# Altium schematic sheet [12]IO_PORT.SchDoc
size A4
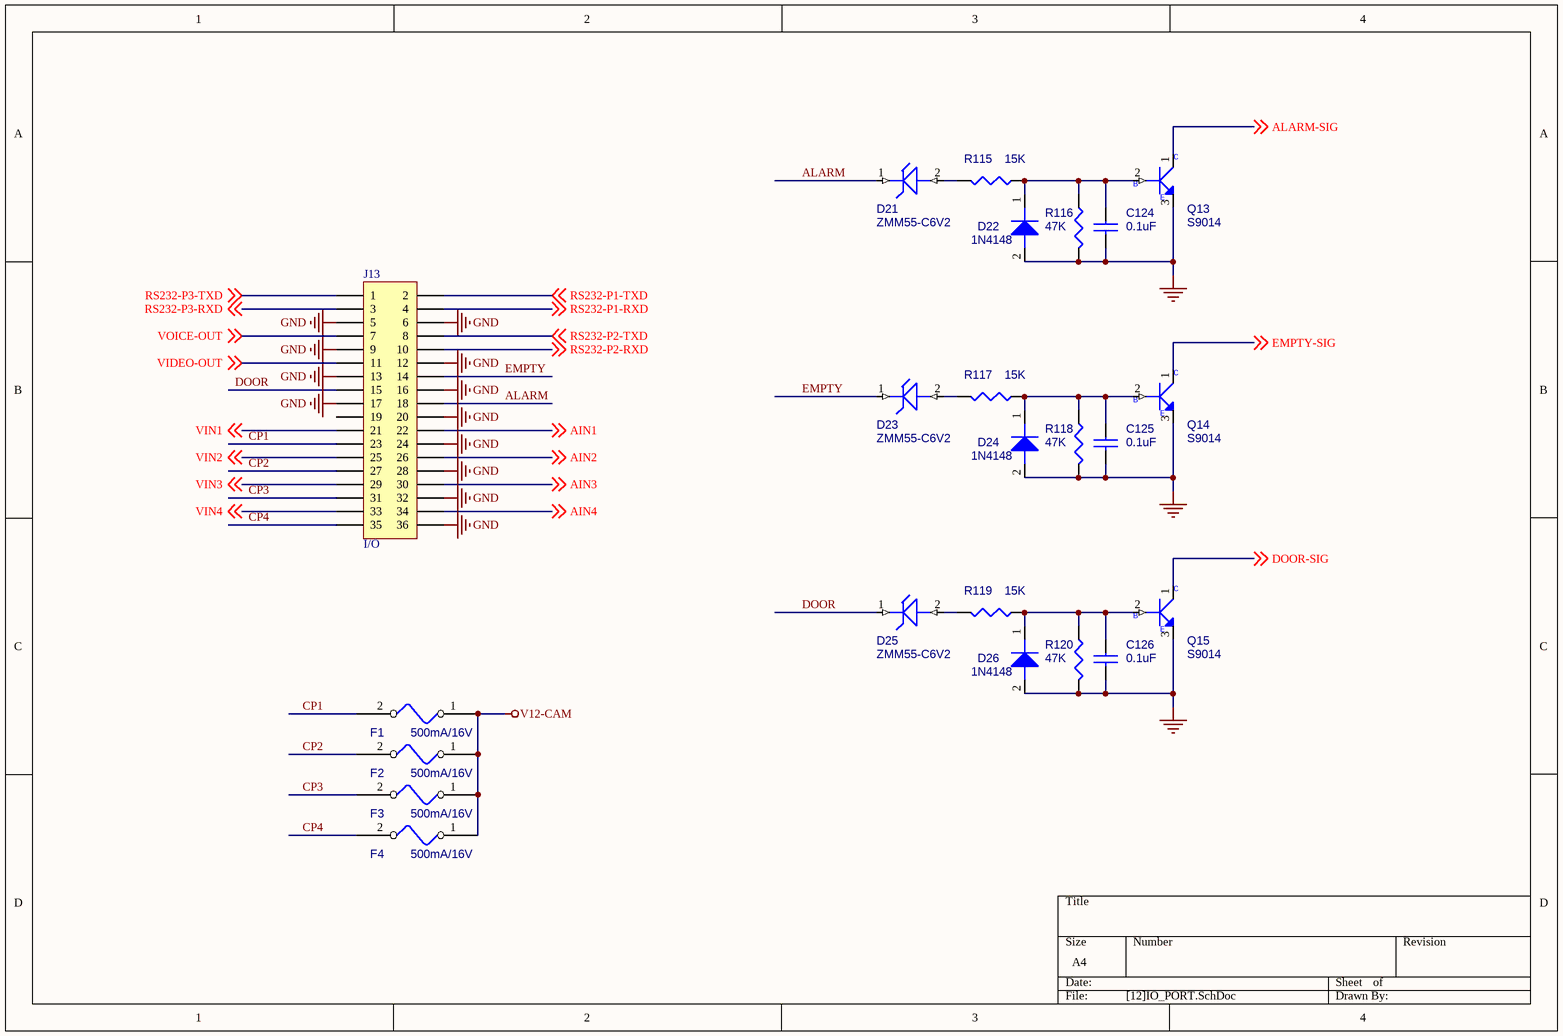
[diagram p0: [12]IO_PORT.SchDoc]

## Parts
C124  0.1uF  [0603]
C125  0.1uF  [0603]
C126  0.1uF  [0603]
D21  ZMM55-C6V2  [MINI-MELF]
D22  1N4148  [MINI-MELF]
D23  ZMM55-C6V2  [MINI-MELF]
D24  1N4148  [MINI-MELF]
D25  ZMM55-C6V2  [MINI-MELF]
D26  1N4148  [MINI-MELF]
F1  500mA/16V  [1812]
F2  500mA/16V  [1812]
F3  500mA/16V  [1812]
F4  500mA/16V  [1812]
J13  I/O  [AMP174146]
Q13  S9014  [NPN]
Q14  S9014  [NPN]
Q15  S9014  [NPN]
R115  15K  [0603]
R116  47K  [0603]
R117  15K  [0603]
R118  47K  [0603]
R119  15K  [0603]
R120  47K  [0603]

## Nets
GND: C124.2 C125.2 C126.2 D22.2 D24.2 D26.2 J13.5 J13.6 J13.9 J13.12 J13.13 J13.16 J13.17 J13.20 J13.24 J13.28 J13.32 J13.36 Q13.3(EMITTER) Q14.3(EMITTER) Q15.3(EMITTER) R116.2 R118.2 R120.2
V12-CAM: F1.1 F2.1 F3.1 F4.1
AIN1: J13.22 ; off-sheet AIN1
AIN2: J13.26 ; off-sheet AIN2
AIN3: J13.30 ; off-sheet AIN3
AIN4: J13.34 ; off-sheet AIN4
ALARM: D21.1 J13.18
ALARM-SIG: Q13.1(COLLECTOR) ; off-sheet ALARM-SIG
CP1: F1.2 J13.23
CP2: F2.2 J13.27
CP3: F3.2 J13.31
CP4: F4.2 J13.35
DOOR: D25.1 J13.15
DOOR-SIG: Q15.1(COLLECTOR) ; off-sheet DOOR-SIG
EMPTY: D23.1 J13.14
EMPTY-SIG: Q14.1(COLLECTOR) ; off-sheet EMPTY-SIG
RS232-P1-RXD: J13.4 ; off-sheet RS232-P1-RXD
RS232-P1-TXD: J13.2 ; off-sheet RS232-P1-TXD
RS232-P2-RXD: J13.10 ; off-sheet RS232-P2-RXD
RS232-P2-TXD: J13.8 ; off-sheet RS232-P2-TXD
RS232-P3-RXD: J13.3 ; off-sheet RS232-P3-RXD
RS232-P3-TXD: J13.1 ; off-sheet RS232-P3-TXD
VIDEO-OUT: J13.11 ; off-sheet VIDEO-OUT
VIN1: J13.21 ; off-sheet VIN1
VIN2: J13.25 ; off-sheet VIN2
VIN3: J13.29 ; off-sheet VIN3
VIN4: J13.33 ; off-sheet VIN4
VOICE-OUT: J13.7 ; off-sheet VOICE-OUT
NetC124_1: C124.1 D22.1 Q13.2(BASE) R115.1 R116.1
NetC125_1: C125.1 D24.1 Q14.2(BASE) R117.1 R118.1
NetC126_1: C126.1 D26.1 Q15.2(BASE) R119.1 R120.1
NetD21_2: D21.2 R115.2
NetD23_2: D23.2 R117.2
NetD25_2: D25.2 R119.2

Not connected (* = marked no-connect by the designer): J13 19

## Notes on the sheet
- (in symbol MMBT3904_NL_SOT23-3) C; B; E

## Library data of the parts
C124-C126 = CAP
D21 D23 D25 = MMGZ5231BPTLL34
D22 D24 D26 = 1N4148WS-7-F_SOD323-2
F1-F4 = 2A_32VDC_0467-002
J13 = Header 18X2H: Header, 18-Pin, Dual row, Right Angle; LatestRevisionDate: 17-Jul-2002; LatestRevisionNote: Re-released for DXP Platform.; Publisher: Altium Limited
Q13-Q15 = MMBT3904_NL_SOT23-3: Part Description: S TR MMBT3904_NL NPN SOT23; Part Number: SB039040000
R115-R120 = R